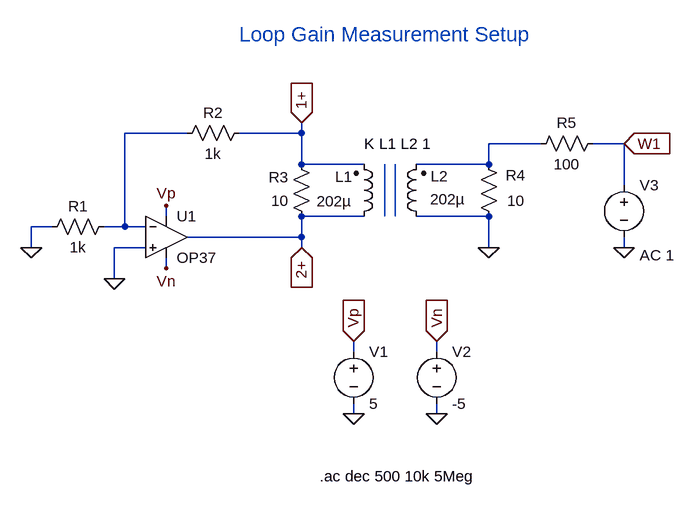
[diagram p0: schematic loop_gain_ltspice.asc]
loop_gain_ltspice.asc, the LTspice schematic file:
Version 4
SHEET 1 1040 680
WIRE 208 0 112 0
WIRE 384 0 384 -16
WIRE 384 0 288 0
WIRE 752 16 672 16
WIRE 880 16 832 16
WIRE 384 48 384 0
WIRE 480 48 384 48
WIRE 672 48 672 16
WIRE 672 48 560 48
WIRE 880 80 880 16
WIRE 176 128 176 112
WIRE 480 128 384 128
WIRE 672 128 560 128
WIRE 0 144 -32 144
WIRE 112 144 112 0
WIRE 112 144 80 144
WIRE 144 144 112 144
WIRE 384 160 384 128
WIRE 384 160 208 160
WIRE -32 176 -32 144
WIRE 144 176 96 176
WIRE 384 176 384 160
WIRE 672 176 672 128
WIRE 880 176 880 160
WIRE 176 208 176 192
WIRE 96 224 96 176
WIRE 464 336 464 320
WIRE 592 336 592 320
WIRE 464 432 464 416
WIRE 592 432 592 416
FLAG 96 224 0
FLAG 672 176 0
FLAG -32 176 0
FLAG 176 112 Vp
FLAG 176 208 Vn
FLAG 384 -16 1+
IOPIN 384 -16 In
FLAG 384 176 2+
IOPIN 384 176 In
FLAG 464 320 Vp
IOPIN 464 320 In
FLAG 592 320 Vn
IOPIN 592 320 In
FLAG 880 16 W1
IOPIN 880 16 In
FLAG 464 432 0
FLAG 592 432 0
FLAG 880 176 0
SYMBOL Opamps\\OP37 176 96 R0
SYMATTR InstName U1
SYMBOL res 96 128 R90
WINDOW 0 0 56 VBottom 2
WINDOW 3 32 56 VTop 2
SYMATTR InstName R1
SYMATTR Value 1k
SYMBOL res 304 -16 R90
WINDOW 0 0 56 VBottom 2
WINDOW 3 32 56 VTop 2
SYMATTR InstName R2
SYMATTR Value 1k
SYMBOL res 400 144 R180
WINDOW 0 36 76 Left 2
WINDOW 3 36 40 Left 2
SYMATTR InstName R3
SYMATTR Value 10
SYMBOL res 688 144 R180
WINDOW 0 -41 79 Left 2
WINDOW 3 -39 40 Left 2
SYMATTR InstName R4
SYMATTR Value 10
SYMBOL res 736 32 R270
WINDOW 0 32 56 VTop 2
WINDOW 3 0 56 VBottom 2
SYMATTR InstName R5
SYMATTR Value 100
SYMBOL ind2 464 144 M180
WINDOW 0 -28 77 Left 2
WINDOW 3 -3 39 Right 2
SYMATTR InstName L1
SYMATTR Value 202µ
SYMATTR Type ind
SYMBOL ind2 576 144 R180
WINDOW 0 -34 78 Left 2
WINDOW 3 -6 42 Right 2
SYMATTR InstName L2
SYMATTR Value 202µ
SYMATTR Type ind
SYMBOL voltage 464 320 R0
SYMATTR InstName V1
SYMATTR Value 5
SYMBOL voltage 592 320 R0
SYMATTR InstName V2
SYMATTR Value -5
SYMBOL voltage 880 64 R0
WINDOW 123 24 124 Left 2
WINDOW 39 0 0 Left 0
SYMATTR InstName V3
SYMATTR Value ""
SYMATTR Value2 AC 1
TEXT 480 16 Left 2 !K L1 L2 1
TEXT 288 -152 Left 3 ;Loop Gain Measurement Setup
TEXT 412 528 Left 2 !.ac dec 500 10k 5Meg
LINE Normal 512 128 512 48
LINE Normal 528 128 528 48

The netlist it stands for:
* loop_gain_ltspice.asc
XU1 0 N001 Vp Vn 2+ LT1037  ; OP37, pins In+ In- V+ V- OUT
R1 N001 0 1k
R2 1+ N001 1k
R3 2+ 1+ 10
R4 0 N002 10
R5 N002 W1 100
L1 2+ 1+ 202µ
L2 0 N002 202µ
V1 Vp 0 5
V2 Vn 0 -5
V3 W1 0 AC 1
K L1 L2 1
* Loop Gain Measurement Setup
.ac dec 500 10k 5Meg
.lib LTC.lib
.backanno
.end